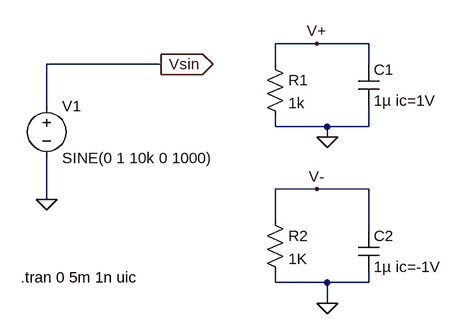
[diagram p0: schematic 03.正弦波.asc]
03.正弦波.asc, the LTspice schematic file:
Version 4
SHEET 1 880 680
WIRE 496 48 432 48
WIRE 576 48 496 48
WIRE 256 80 80 80
WIRE 432 80 432 48
WIRE 576 80 576 48
WIRE 80 144 80 80
WIRE 432 176 432 160
WIRE 512 176 432 176
WIRE 576 176 576 144
WIRE 576 176 512 176
WIRE 512 192 512 176
WIRE 496 272 432 272
WIRE 576 272 496 272
WIRE 80 288 80 224
WIRE 432 320 432 272
WIRE 576 336 576 272
WIRE 432 416 432 400
WIRE 512 416 432 416
WIRE 576 416 576 400
WIRE 576 416 512 416
WIRE 512 448 512 416
FLAG 80 288 0
FLAG 512 192 0
FLAG 256 80 Vsin
IOPIN 256 80 Out
FLAG 512 448 0
FLAG 496 48 V+
FLAG 496 272 V-
SYMBOL voltage 80 128 R0
WINDOW 123 0 0 Left 0
WINDOW 39 0 0 Left 0
SYMATTR InstName V1
SYMATTR Value SINE(0 1 10k 0 1000)
SYMBOL res 416 64 R0
SYMATTR InstName R1
SYMATTR Value 1k
SYMBOL res 416 304 R0
SYMATTR InstName R2
SYMATTR Value 1K
SYMBOL cap 560 80 R0
SYMATTR InstName C1
SYMATTR Value 1µ ic=1V
SYMBOL cap 560 336 R0
SYMATTR InstName C2
SYMATTR Value 1µ ic=-1V
TEXT 40 408 Left 2 !.tran 0 5m 1n uic

The netlist it stands for:
* 03.正弦波.asc
V1 Vsin 0 SINE(0 1 10k 0 1000)
R1 V+ 0 1k
R2 V- 0 1K
C1 V+ 0 1µ ic=1V
C2 V- 0 1µ ic=-1V
.tran 0 5m 1n uic
.backanno
.end